# Altium schematic sheet Sheet2.SchDoc
size A4; SheetNumber: 1; SheetTotal: 1
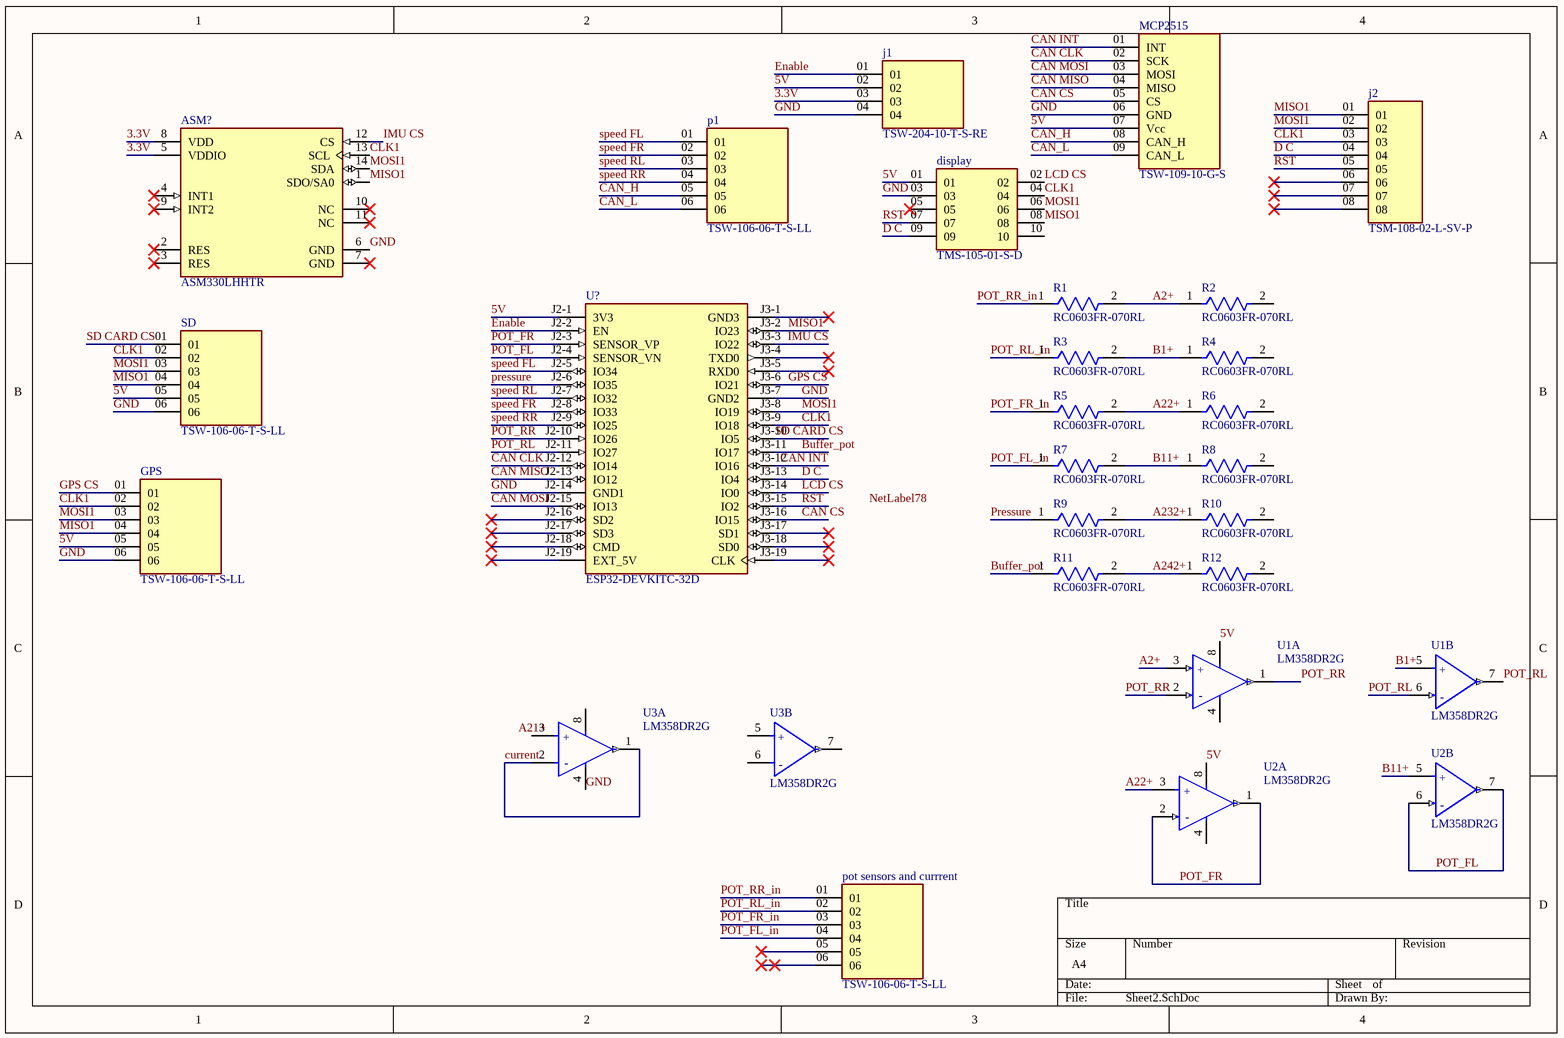
[diagram p0: Sheet2.SchDoc]

## Parts
ASM?  ASM330LHHTR  [FP-LGA-14L-DM00249496-MFG]
display  TMS-105-01-S-D  [SAMTEC_TMS-105-01-S-D]
GPS  TSW-106-06-T-S-LL  [SAMTEC_TSW-106-06-T-S-LL]
j1  TSW-204-10-T-S-RE  [SAMTEC_TSW-204-10-T-S-RE]
j2  TSM-108-02-L-SV-P  [SAMTEC_TSM-108-02-L-SV-P]
MCP2515  TSW-109-10-G-S  [SAMTEC_TSW-109-10-G-S]
p1  TSW-106-06-T-S-LL  [SAMTEC_TSW-106-06-T-S-LL]
pot_sensors_and_currrent  TSW-106-06-T-S-LL  [SAMTEC_TSW-106-06-T-S-LL]
R1  RC0603FR-070RL  [FP-RC0603-MFG]
R2  RC0603FR-070RL  [FP-RC0603-MFG]
R3  RC0603FR-070RL  [FP-RC0603-MFG]
R4  RC0603FR-070RL  [FP-RC0603-MFG]
R5  RC0603FR-070RL  [FP-RC0603-MFG]
R6  RC0603FR-070RL  [FP-RC0603-MFG]
R7  RC0603FR-070RL  [FP-RC0603-MFG]
R8  RC0603FR-070RL  [FP-RC0603-MFG]
R9  RC0603FR-070RL  [FP-RC0603-MFG]
R10  RC0603FR-070RL  [FP-RC0603-MFG]
R11  RC0603FR-070RL  [FP-RC0603-MFG]
R12  RC0603FR-070RL  [FP-RC0603-MFG]
SD  TSW-106-06-T-S-LL  [SAMTEC_TSW-106-06-T-S-LL]
U1  LM358DR2G  [FP-751-07-IPC_C]  (parts A,B of 2)
U2  LM358DR2G  [FP-751-07-IPC_C]  (parts A,B of 2)
U3  LM358DR2G  [FP-751-07-IPC_C]  (parts A,B of 2)
U?  ESP32-DEVKITC-32D  [MODULE_ESP32-DEVKITC-32D]

## Nets
3.3V: ASM?.5(VDDIO) ASM?.8(VDD) j1.03
5V: display.01 GPS.05 j1.02 MCP2515.07(Vcc) SD.05 U1.8(VCC) U2.8(VCC) U?.J2-1(3V3)
A2+: R1.2 R2.1 U1.3(INPUT_A+)
A22+: R5.2 R6.1 U2.3(INPUT_A+)
A232+: R9.2 R10.1
A242+: R11.2 R12.1
B1+: R3.2 R4.1 U1.5(INPUT_B+)
B11+: R7.2 R8.1 U2.5(INPUT_B+)
Buffer_pot: R11.1 U?.J3-11(IO17)
CAN CLK: MCP2515.02(SCK) U?.J2-12(IO14)
CAN CS: MCP2515.05(CS) U?.J3-16(IO15)
CAN INT: MCP2515.01(INT) U?.J3-12(IO16)
CAN MISO: MCP2515.04(MISO) U?.J2-13(IO12)
CAN MOSI: MCP2515.03(MOSI) U?.J2-15(IO13)
CAN_H: MCP2515.08(CAN_H) p1.05
CAN_L: MCP2515.09(CAN_L) p1.06
CLK1: ASM?.13(SCL) display.04 GPS.02 j2.03 SD.02 U?.J3-9(IO18)
current: U3.1(OUTPUT_A) U3.2(INPUT_A-)
D C: display.09 j2.04 U?.J3-13(IO4)
Enable: j1.01 U?.J2-2(EN)
GND: ASM?.6(GND) display.03 GPS.06 j1.04 MCP2515.06(GND) SD.06 U3.4(VEE/GND) U?.J2-14(GND1) U?.J3-7(GND2)
GPS CS: GPS.01 U?.J3-6(IO21)
IMU CS: ASM?.12(CS) U?.J3-3(IO22)
LCD CS: display.02 U?.J3-14(IO0)
MISO1: ASM?.1(SDO/SA0) display.08 GPS.04 j2.01 SD.04 U?.J3-2(IO23)
MOSI1: ASM?.14(SDA) display.06 GPS.03 j2.02 SD.03 U?.J3-8(IO19)
POT_FL : U2.6(INPUT_B-) U2.7(OUTPUT_B) U?.J2-4(SENSOR_VN)
POT_FL_in: pot_sensors_and_currrent.04 R7.1
POT_FR : U2.1(OUTPUT_A) U2.2(INPUT_A-) U?.J2-3(SENSOR_VP)
POT_FR_in: pot_sensors_and_currrent.03 R5.1
POT_RL: U1.6(INPUT_B-) U1.7(OUTPUT_B) U?.J2-11(IO27)
POT_RL_in: pot_sensors_and_currrent.02 R3.1
POT_RR: U1.1(OUTPUT_A) U1.2(INPUT_A-) U?.J2-10(IO26)
POT_RR_in: pot_sensors_and_currrent.01 R1.1
Pressure: R9.1 U?.J2-6(IO35)
RST: display.07 j2.05 U?.J3-15(IO2)
SD CARD CS: SD.01 U?.J3-10(IO5)
speed FL: p1.01 U?.J2-5(IO34)
speed FR: p1.02 U?.J2-8(IO33)
speed RL: p1.03 U?.J2-7(IO32)
speed RR: p1.04 U?.J2-9(IO25)

Not connected (* = marked no-connect by the designer): ASM? 2(RES)* 3(RES)* 4(INT1)* 7(GND)* 9(INT2)* 10(NC)* 11(NC)*; display 05* 10; j2 06* 07* 08*; pot_sensors_and_currrent 05* 06*; R2 2; R4 2; R6 2; R8 2; R10 2; R12 2; U1 4(VEE/GND); U2 4(VEE/GND); U3 3(INPUT_A+) 5(INPUT_B+) 6(INPUT_B-) 7(OUTPUT_B) 8(VCC); U? J2-16(SD2)* J2-17(SD3)* J2-18(CMD)* J2-19(EXT_5V)* J3-1(GND3)* J3-4(TXD0)* J3-5(RXD0)* J3-17(SD1)* J3-18(SD0)* J3-19(CLK)*

## Notes on the sheet
- Labels drawn without touching a wire or pin: A21+, NetLabel78
- (in symbol CMP-1310-00291-2, part A) +; -
- (in symbol CMP-1310-00291-2, part B) +; -

## Library data of the parts
ASM? = CMP-12177-000004-1: AUTOMOTIVE 6-AXIS INERTIAL MODUL; Manufacturer: STMicroelectronics; Sensor Type: Temperature,Accelerometer,Gyroscope; Max Supply Voltage: 3.6V; Min Supply Voltage: 1.62V; Resolution: 16bits; Operating Supply Current: 360-1300uA; Accel Range: 2/4/8/16g; Sensor Output: I2C,SPI; Gyro Range: 125/250/500/1000/2000/4000°/s; Automotive Grade: Grade 2; Footprint Url: https://www.st.com/content/ccc/resource/technical/document/technical_note/73/17/9c/16/dd/96/4a/01/CD00134799.pdf/files/CD00134799.pdf/jcr:content/translations/en.CD00134799.pdf; Height: 0.86mm; Package: LGA-14L-DM00249496; Mouser Description: Automotive 6-Axis Inertial Module 3D Accelerometer and 3D Gyroscope 14-Pin LGA T/R; Lead Free: Yes; Temperature Range Low: -40°C; Category: IC; Device Class L3: Inertial Measurement Units (IMUs); ComponentLink2URL: https://www.st.com/resource/en/datasheet/asm330lhh.pdf; Device Class L1: Sensors; Device Class L2: Motion Sensors; Octopart: https://octopart.com/asm330lhhtr-stmicroelectronics-93180171; RoHS: TRUE; ComponentLink2Description: Datasheet; Digikey Description: AUTOMOTIVE 6-AXIS INERTIAL MODUL; Temperature: -40°C to +105°C; Temperature Range High: +105°C; Manufacturer Part Number: ASM330LHHTR; Automotive: Yes
j1 = TSW-204-10-T-S-RE: Connector Header Through Hole 4 position 0.200 (5.08mm); MF: Samtec; SnapEDA_Link: https://www.snapeda.com/parts/TSW-204-10-T-S-RE/Samtec/view-part/?ref=snap; Package: None; Value: *; MP: TSW-204-10-T-S-RE; Check_prices: https://www.snapeda.com/parts/TSW-204-10-T-S-RE/Samtec/view-part/?ref=eda
j2 = TSM-108-02-L-SV-P: MF: {'manufacturer': u'Samtec'}; Package: None; MP: TSM-108-02-L-SV-P; Value: *; Price: None; Availability: Unavailable
R1-R12 = CMP-2000-06925-2: RES SMD 0 OHM JUMPER 1/10W 0603; Manufacturer: Yageo; Tolerance: 1%; Value: 0Ω; Power Rating: 0.1W; Voltage Rating: 75V; Composition: Thick Film; Temperature Range Low: -55°C; Ipc Land Pattern Name: RESC16080X45; Lead Free: Yes; Digikey Description: RES SMD 0 OHM JUMPER 1/10W 0603; Height: 0.55mm; Automotive: No; Device Class L3: Chip SMD Resistors; Device Class L1: Passive Components; Device Class L2: Resistors; Footprint Url: http://www.yageo.com/exep/pages/download/literatures/PYu-R_Mount_10.pdf; Category: Res; Mouser Description: RC Series 0603 0.1 W 0 O Jumper Surface Mount Thick Film Chip Resistor; Resistance: 0Ω; ComponentLink2URL: http://www.yageo.com/documents/recent/PYu-RC_Group_51_RoHS_L_10.pdf; Series: RC_L; ComponentLink2Description: Datasheet; RoHS: TRUE; Temperature: -55°C to +155°C; Temperature Range High: +155°C; Package: RC0603; Octopart: https://octopart.com/rc0603fr-070rl-yageo-1180803; Manufacturer Part Number: RC0603FR-070RL
U1-U3 = CMP-1310-00291-2: IC OPAMP GP 2 CIRCUIT 8SOIC; Gain Bandwidth Product: 1MHz; Number of Circuits: 2; Min Supply Voltage: 3V; Slew Rate: 0.6V/µs; Max Dual Supply Voltage: 16V; Common Mode Rejection Ratio: 65dB; Input Bias Current: 250nA; Min Dual Supply Voltage: 1.5V; Dual Supply Voltage: 9V; Operating Supply Current: 1.5mA; Output Current: 40mA; Input Offset Voltage (Vos): 7mV; Nominal Supply Current: 1.2mA; Voltage Gain: 100dB; Max Supply Voltage: 32V; Width: 4mm; Number of Pins: 8; Min Operating Temperature: 0°C; REACH SVHC: No SVHC; Contact Plating: Tin; Lead Free: Lead Free; Halogen Free: Halogen Free; Power Supply Rejection Ratio (PSRR): 65dB; Operating Supply Voltage: 16V; Package Quantity: 2500; Max Operating Temperature: 70°C; Case/Package: SOIC; Height: 1.5mm; Packaging: Tape and Reel; Radiation Hardening: No; Number of Channels: 2; Bandwidth: 1MHz; Length: 5mm; Number of Elements: 2; Number of Amplifiers: 2; Output Current per Channel: 40mA
U? = ESP32-DEVKITC-32D: WiFi Development Tools (802.11) ESP32 General Development Kit, ESP32-WROOM-32D on the board; MF: Espressif Systems; SnapEDA_Link: https://www.snapeda.com/parts/ESP32-DEVKITC-32D/Espressif+Systems/view-part/?ref=snap; Package: None; Value: *; MP: ESP32-DEVKITC-32D; Check_prices: https://www.snapeda.com/parts/ESP32-DEVKITC-32D/Espressif+Systems/view-part/?ref=eda
display = TMS-105-01-S-D: Package: None; Price: None; Value: *; MP: TMS-105-01-S-D; Availability: Unavailable
GPS p1 pot_sensors_and_currrent SD = TSW-106-06-T-S-LL: Package: None; Price: None; Value: *; MP: TSW-106-06-T-S-LL; Availability: Unavailable
MCP2515 = TSW-109-10-G-S: Package: None; Price: None; Value: *; MP: TSW-109-10-G-S; Availability: Unavailable